# EAGLE schematic untitled (EAGLE 7.6.0)
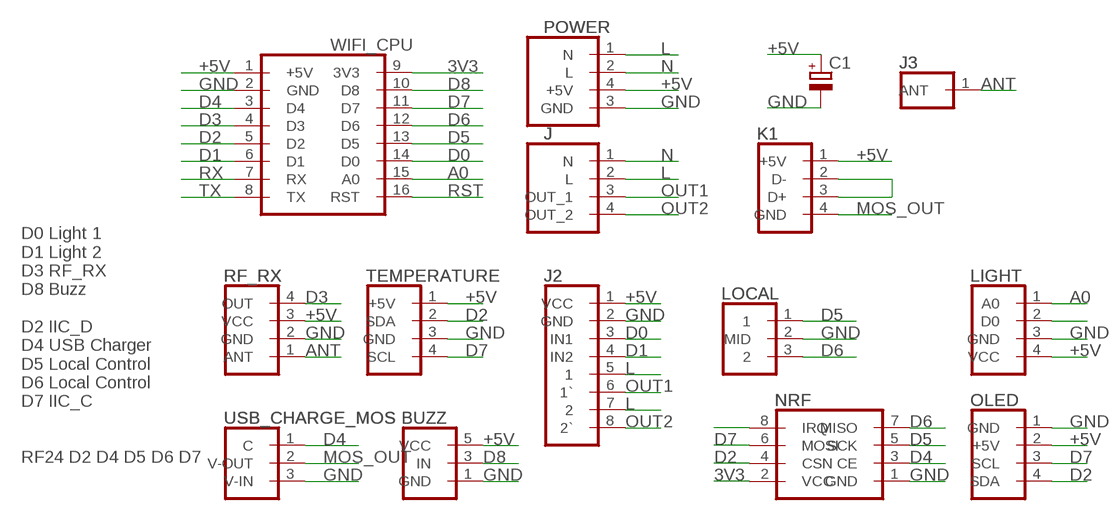
[diagram p0: schematic, sheet 1]

## Parts
BUZZ  BUZZ_MODULE  [BUZZ_MODULE]
C1  CPOL-EUE5-5  [E5-5]
J  OUT_HEAD_4_AC_2CH  [OUT_HEAD_4_AC_2CH]
J2  2_SOLID_RELAY  [2_SOLID_RELAY]
J3  ANT_315  [ANT_315]
K1  USB_OUTUSB_V  [USB_V_OUT]
LIGHT  LIGHT_DEC  [LIGHT_DEC]
LOCAL  SELECT_3  [SELECT_3]
NRF  NRF24L01_MODULE  [NRF24L01]
OLED  IIC_OLED  [IIC_OLED]
POWER  AC_DC5V2A  [AC_DC_5V2A]
RF_RX  315MHZ_RX_SMT  [315MHZ_RX_SMT]
TEMPERATURE  IIC_TEMPERATURE  [IIC_TEMPERATURE]
USB_CHARGE_MOS  MOS_IRF520  [MOS_IRF520]
WIFI_CPU  ESP8266_MINI  [ESP8266_MINI]

## Nets
3V3: NRF.2(VCC) WIFI_CPU.9(3V3)
+5V: BUZZ.5(VCC) C1.+ J2.1(VCC) K1.1(+5V) LIGHT.4(VCC) OLED.2(+5V) POWER.4(+5V) RF_RX.3(VCC) TEMPERATURE.1(+5V) WIFI_CPU.1(+5V)
A0: LIGHT.1(A0) WIFI_CPU.15(A0)
ANT: J3.1(ANT) RF_RX.1(ANT)
D0: J2.3(IN1) WIFI_CPU.14(D0)
D1: J2.4(IN2) WIFI_CPU.6(D1)
D2: NRF.4(CSN) OLED.4(SDA) TEMPERATURE.2(SDA) WIFI_CPU.5(D2)
D3: RF_RX.4(OUT) WIFI_CPU.4(D3)
D4: NRF.3(CE) USB_CHARGE_MOS.1(C) WIFI_CPU.3(D4)
D5: LOCAL.1 NRF.5(SCK) WIFI_CPU.13(D5)
D6: LOCAL.3 NRF.7(MISO) WIFI_CPU.12(D6)
D7: NRF.6(MOSI) OLED.3(SCL) TEMPERATURE.4(SCL) WIFI_CPU.11(D7)
D8: BUZZ.3(IN) WIFI_CPU.10(D8)
GND: BUZZ.1(GND) C1.- J2.2(GND) LIGHT.3(GND) LOCAL.2(MID) NRF.1(GND) OLED.1(GND) POWER.3(GND) RF_RX.2(GND) TEMPERATURE.3(GND) USB_CHARGE_MOS.3(V-IN) WIFI_CPU.2(GND)
L: J2.5 J2.7 J.2(L) POWER.1(N)
MOS_OUT: K1.4(GND) USB_CHARGE_MOS.2(V-OUT)
N: J.1(N) POWER.2(L)
N$2: K1.2(D-) K1.3(D+)
N$3: LIGHT.2(D0)
N$6: NRF.8(IRQ)
OUT1: J2.6(1`) J.3(OUT_1)
OUT2: J2.8(2`) J.4(OUT_2)
RST: WIFI_CPU.16(RST)
RX: WIFI_CPU.7(RX)
TX: WIFI_CPU.8(TX)

## Notes on the sheet
- D0 Light 1
  D1 Light 2
  D3 RF_RX
  D8 Buzz
  
  D2 IIC_D
  D4 USB Charger
  D5 Local Control
  D6 Local Control
  D7 IIC_C
  
  
  RF24 D2 D4 D5 D6 D7

## Library data of the parts
BUZZ = rx:BUZZ_MODULE: Multi connection point. Often used as Generic Header-pin footprint for 0.1 inch spaced/style header connections On any of the 0.1 inch spaced packages, you can populate with these: Break Away Headers - Straight <https://www.sparkfun.com/products/116> (PRT-00116) Break Away Male Headers - Right Angle <https://www.sparkfun.com/products/553> (PRT-00553) Female Headers <https://www.sparkfun.com/products/115> (PRT-00115) Break Away Headers - Machine Pin <https://www.sparkfun.com/products/117> (PRT-00117) Break Away Female Headers - Swiss Machine Pin <https://www.sparkfun.com/products/743> (PRT-00743)
C1 = resistor:CPOL-EU: POLARIZED CAPACITOR, European symbol
J = rx:OUT_HEAD_4_AC_2CH: Multi connection point. Often used as Generic Header-pin footprint for 0.1 inch spaced/style header connections On any of the 0.1 inch spaced packages, you can populate with these: Break Away Headers - Straight <https://www.sparkfun.com/products/116> (PRT-00116) Break Away Male Headers - Right Angle <https://www.sparkfun.com/products/553> (PRT-00553) Female Headers <https://www.sparkfun.com/products/115> (PRT-00115) Break Away Headers - Machine Pin <https://www.sparkfun.com/products/117> (PRT-00117) Break Away Female Headers - Swiss Machine Pin <https://www.sparkfun.com/products/743> (PRT-00743)
J2 = rx:2_SOLID_RELAY: Multi connection point. Often used as Generic Header-pin footprint for 0.1 inch spaced/style header connections On any of the 0.1 inch spaced packages, you can populate with these: Break Away Headers - Straight <https://www.sparkfun.com/products/116> (PRT-00116) Break Away Male Headers - Right Angle <https://www.sparkfun.com/products/553> (PRT-00553) Female Headers <https://www.sparkfun.com/products/115> (PRT-00115) Break Away Headers - Machine Pin <https://www.sparkfun.com/products/117> (PRT-00117) Break Away Female Headers - Swiss Machine Pin <https://www.sparkfun.com/products/743> (PRT-00743)
J3 = rx:ANT_315: Multi connection point. Often used as Generic Header-pin footprint for 0.1 inch spaced/style header connections On any of the 0.1 inch spaced packages, you can populate with these: Break Away Headers - Straight <https://www.sparkfun.com/products/116> (PRT-00116) Break Away Male Headers - Right Angle <https://www.sparkfun.com/products/553> (PRT-00553) Female Headers <https://www.sparkfun.com/products/115> (PRT-00115) Break Away Headers - Machine Pin <https://www.sparkfun.com/products/117> (PRT-00117) Break Away Female Headers - Swiss Machine Pin <https://www.sparkfun.com/products/743> (PRT-00743)
K1 = rx:USB_OUT: Multi connection point. Often used as Generic Header-pin footprint for 0.1 inch spaced/style header connections On any of the 0.1 inch spaced packages, you can populate with these: Break Away Headers - Straight <https://www.sparkfun.com/products/116> (PRT-00116) Break Away Male Headers - Right Angle <https://www.sparkfun.com/products/553> (PRT-00553) Female Headers <https://www.sparkfun.com/products/115> (PRT-00115) Break Away Headers - Machine Pin <https://www.sparkfun.com/products/117> (PRT-00117) Break Away Female Headers - Swiss Machine Pin <https://www.sparkfun.com/products/743> (PRT-00743)
LIGHT = rx:LIGHT_DEC: Multi connection point. Often used as Generic Header-pin footprint for 0.1 inch spaced/style header connections On any of the 0.1 inch spaced packages, you can populate with these: Break Away Headers - Straight <https://www.sparkfun.com/products/116> (PRT-00116) Break Away Male Headers - Right Angle <https://www.sparkfun.com/products/553> (PRT-00553) Female Headers <https://www.sparkfun.com/products/115> (PRT-00115) Break Away Headers - Machine Pin <https://www.sparkfun.com/products/117> (PRT-00117) Break Away Female Headers - Swiss Machine Pin <https://www.sparkfun.com/products/743> (PRT-00743)
LOCAL = rx:SELECT_3: Multi connection point. Often used as Generic Header-pin footprint for 0.1 inch spaced/style header connections On any of the 0.1 inch spaced packages, you can populate with these: Break Away Headers - Straight <https://www.sparkfun.com/products/116> (PRT-00116) Break Away Male Headers - Right Angle <https://www.sparkfun.com/products/553> (PRT-00553) Female Headers <https://www.sparkfun.com/products/115> (PRT-00115) Break Away Headers - Machine Pin <https://www.sparkfun.com/products/117> (PRT-00117) Break Away Female Headers - Swiss Machine Pin <https://www.sparkfun.com/products/743> (PRT-00743)
NRF = rx:NRF24L01_MODULE: Multi connection point. Often used as Generic Header-pin footprint for 0.1 inch spaced/style header connections On any of the 0.1 inch spaced packages, you can populate with these: Break Away Headers - Straight <https://www.sparkfun.com/products/116> (PRT-00116) Break Away Male Headers - Right Angle <https://www.sparkfun.com/products/553> (PRT-00553) Female Headers <https://www.sparkfun.com/products/115> (PRT-00115) Break Away Headers - Machine Pin <https://www.sparkfun.com/products/117> (PRT-00117) Break Away Female Headers - Swiss Machine Pin <https://www.sparkfun.com/products/743> (PRT-00743)
OLED = rx:IIC_OLED: Multi connection point. Often used as Generic Header-pin footprint for 0.1 inch spaced/style header connections On any of the 0.1 inch spaced packages, you can populate with these: Break Away Headers - Straight <https://www.sparkfun.com/products/116> (PRT-00116) Break Away Male Headers - Right Angle <https://www.sparkfun.com/products/553> (PRT-00553) Female Headers <https://www.sparkfun.com/products/115> (PRT-00115) Break Away Headers - Machine Pin <https://www.sparkfun.com/products/117> (PRT-00117) Break Away Female Headers - Swiss Machine Pin <https://www.sparkfun.com/products/743> (PRT-00743)
POWER = rx:AC_DC: Multi connection point. Often used as Generic Header-pin footprint for 0.1 inch spaced/style header connections On any of the 0.1 inch spaced packages, you can populate with these: Break Away Headers - Straight <https://www.sparkfun.com/products/116> (PRT-00116) Break Away Male Headers - Right Angle <https://www.sparkfun.com/products/553> (PRT-00553) Female Headers <https://www.sparkfun.com/products/115> (PRT-00115) Break Away Headers - Machine Pin <https://www.sparkfun.com/products/117> (PRT-00117) Break Away Female Headers - Swiss Machine Pin <https://www.sparkfun.com/products/743> (PRT-00743)
RF_RX = rx:315MHZ_RX_SMT: Multi connection point. Often used as Generic Header-pin footprint for 0.1 inch spaced/style header connections On any of the 0.1 inch spaced packages, you can populate with these: Break Away Headers - Straight <https://www.sparkfun.com/products/116> (PRT-00116) Break Away Male Headers - Right Angle <https://www.sparkfun.com/products/553> (PRT-00553) Female Headers <https://www.sparkfun.com/products/115> (PRT-00115) Break Away Headers - Machine Pin <https://www.sparkfun.com/products/117> (PRT-00117) Break Away Female Headers - Swiss Machine Pin <https://www.sparkfun.com/products/743> (PRT-00743)
TEMPERATURE = rx:IIC_TEMPERATURE: Multi connection point. Often used as Generic Header-pin footprint for 0.1 inch spaced/style header connections On any of the 0.1 inch spaced packages, you can populate with these: Break Away Headers - Straight <https://www.sparkfun.com/products/116> (PRT-00116) Break Away Male Headers - Right Angle <https://www.sparkfun.com/products/553> (PRT-00553) Female Headers <https://www.sparkfun.com/products/115> (PRT-00115) Break Away Headers - Machine Pin <https://www.sparkfun.com/products/117> (PRT-00117) Break Away Female Headers - Swiss Machine Pin <https://www.sparkfun.com/products/743> (PRT-00743)
USB_CHARGE_MOS = rx:MOS_IRF520: Multi connection point. Often used as Generic Header-pin footprint for 0.1 inch spaced/style header connections On any of the 0.1 inch spaced packages, you can populate with these: Break Away Headers - Straight <https://www.sparkfun.com/products/116> (PRT-00116) Break Away Male Headers - Right Angle <https://www.sparkfun.com/products/553> (PRT-00553) Female Headers <https://www.sparkfun.com/products/115> (PRT-00115) Break Away Headers - Machine Pin <https://www.sparkfun.com/products/117> (PRT-00117) Break Away Female Headers - Swiss Machine Pin <https://www.sparkfun.com/products/743> (PRT-00743)
WIFI_CPU = rx:ESP8266_MINI: Multi connection point. Often used as Generic Header-pin footprint for 0.1 inch spaced/style header connections On any of the 0.1 inch spaced packages, you can populate with these: Break Away Headers - Straight <https://www.sparkfun.com/products/116> (PRT-00116) Break Away Male Headers - Right Angle <https://www.sparkfun.com/products/553> (PRT-00553) Female Headers <https://www.sparkfun.com/products/115> (PRT-00115) Break Away Headers - Machine Pin <https://www.sparkfun.com/products/117> (PRT-00117) Break Away Female Headers - Swiss Machine Pin <https://www.sparkfun.com/products/743> (PRT-00743)